# Altium schematic sheet PDC.SchDoc
size C
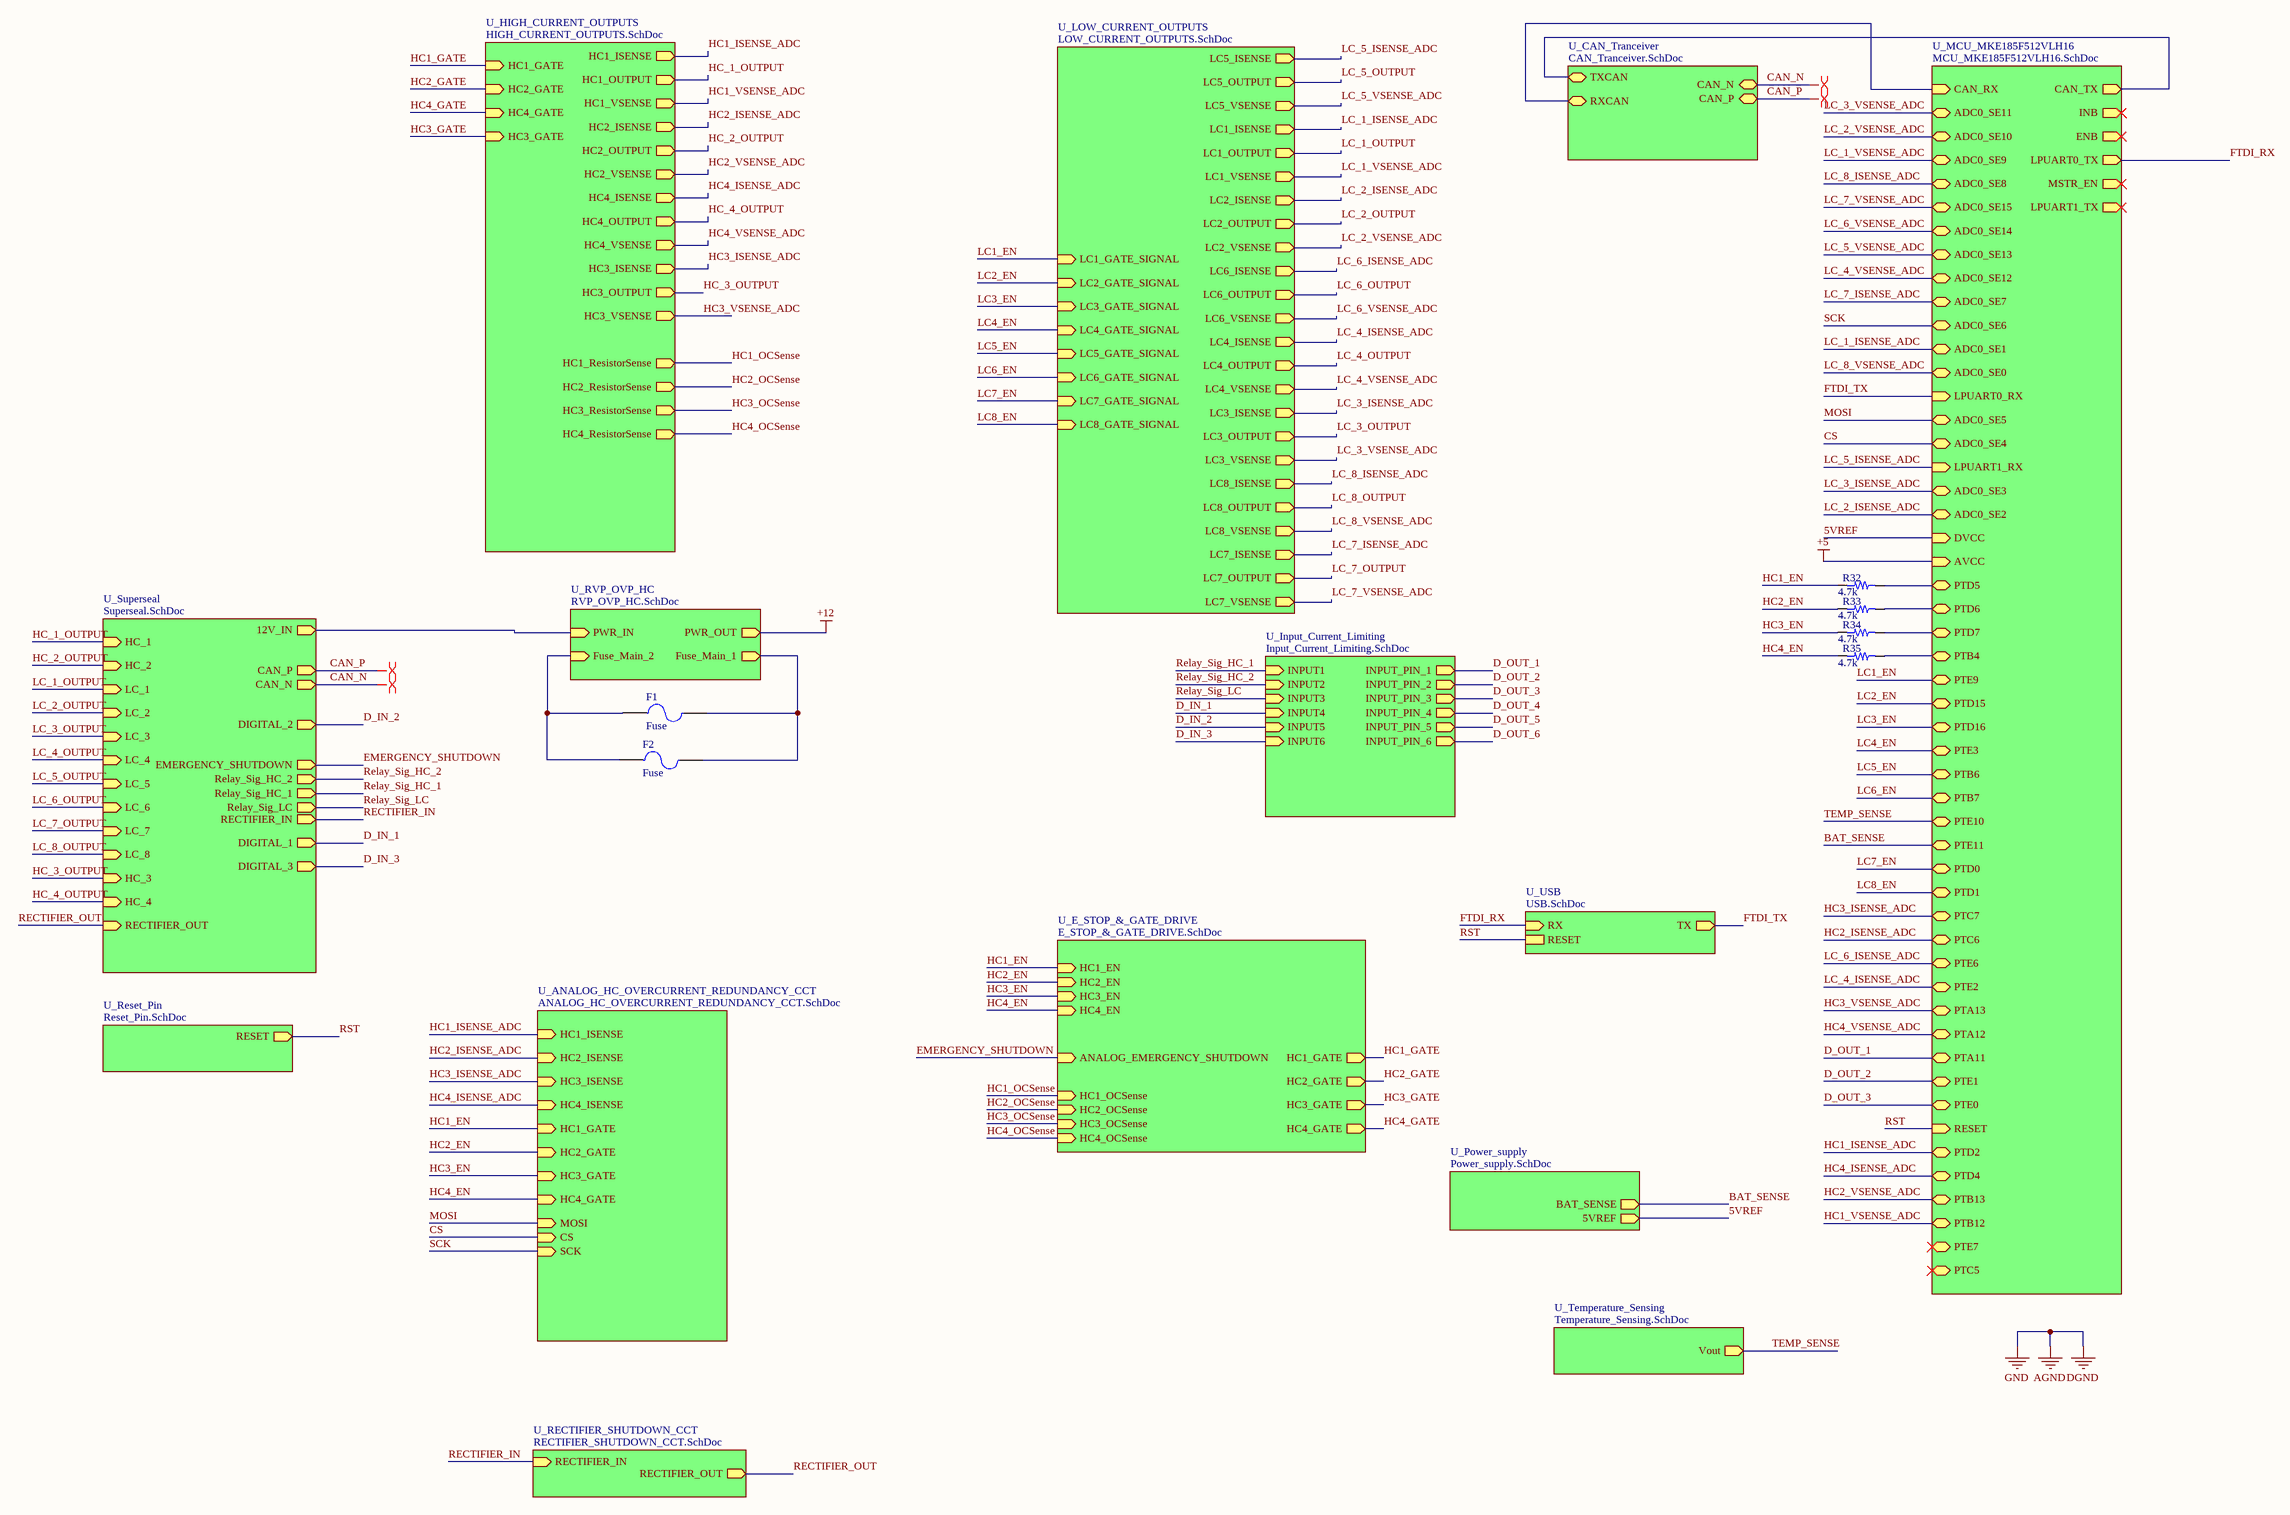
[diagram p0: PDC.SchDoc]

## Parts
F1  Fuse  [3568-MiniFuseHolder]
F2  Fuse  [3568-MiniFuseHolder]
R32  4.7k  [RES 0603/1608]
R33  4.7k  [RES 0603/1608]
R34  4.7k  [RES 0603/1608]
R35  4.7k  [RES 0603/1608]

## Sub-sheets
U_ANALOG_HC_OVERCURRENT_REDUNDANCY_CCT = ANALOG_HC_OVERCURRENT_REDUNDANCY_CCT.SchDoc: HC1_ISENSE (in), HC2_ISENSE (in), HC3_ISENSE (in), HC4_ISENSE (in), HC1_GATE (in), HC2_GATE (in), HC3_GATE (in), HC4_GATE (in), MOSI (in), CS (in), SCK (in)
U_CAN_Tranceiver = CAN_Tranceiver.SchDoc: TXCAN (bidir), RXCAN (bidir), CAN_N (bidir), CAN_P (bidir)
U_E_STOP_&_GATE_DRIVE = E_STOP_&_GATE_DRIVE.SchDoc: HC1_GATE (out), HC2_GATE (out), HC3_GATE (out), HC4_GATE (out), HC1_EN (in), HC4_EN (in), HC3_EN (in), HC2_EN (in), ANALOG_EMERGENCY_SHUTDOWN (in), HC1_OCSense (in), HC2_OCSense (in), HC4_OCSense (in), HC3_OCSense (in)
U_HIGH_CURRENT_OUTPUTS = HIGH_CURRENT_OUTPUTS.SchDoc: HC1_GATE (in), HC1_ISENSE (out), HC1_OUTPUT (out), HC1_VSENSE (out), HC2_GATE (in), HC2_ISENSE (out), HC2_OUTPUT (out), HC2_VSENSE (out), HC4_GATE (in), HC4_ISENSE (out), HC4_OUTPUT (out), HC4_VSENSE (out), HC3_GATE (in), HC3_ISENSE (out), HC3_OUTPUT (out), HC3_VSENSE (out), HC3_ResistorSense (out), HC4_ResistorSense (out), HC2_ResistorSense (out), HC1_ResistorSense (out)
U_Input_Current_Limiting = Input_Current_Limiting.SchDoc: INPUT_PIN_1 (out), INPUT_PIN_2 (out), INPUT1 (in), INPUT2 (in), INPUT_PIN_3 (out), INPUT3 (in), INPUT4 (in), INPUT_PIN_4 (out), INPUT_PIN_5 (out), INPUT5 (in), INPUT6 (in), INPUT_PIN_6 (out)
U_LOW_CURRENT_OUTPUTS = LOW_CURRENT_OUTPUTS.SchDoc: LC5_ISENSE (out), LC5_OUTPUT (out), LC5_VSENSE (out), LC1_ISENSE (out), LC1_OUTPUT (out), LC1_VSENSE (out), LC2_ISENSE (out), LC2_OUTPUT (out), LC2_VSENSE (out), LC6_ISENSE (out), LC6_OUTPUT (out), LC6_VSENSE (out), LC4_ISENSE (out), LC4_OUTPUT (out), LC4_VSENSE (out), LC3_ISENSE (out), LC3_OUTPUT (out), LC3_VSENSE (out), LC8_ISENSE (out), LC8_OUTPUT (out), LC8_VSENSE (out), LC7_ISENSE (out), LC7_OUTPUT (out), LC7_VSENSE (out), LC1_GATE_SIGNAL (in), LC2_GATE_SIGNAL (in), LC3_GATE_SIGNAL (in), LC4_GATE_SIGNAL (in), LC5_GATE_SIGNAL (in), LC6_GATE_SIGNAL (in), LC7_GATE_SIGNAL (in), LC8_GATE_SIGNAL (in)
U_MCU_MKE185F512VLH16 = MCU_MKE185F512VLH16.SchDoc: CAN_TX (out), CAN_RX (in), INB (out), ENB (out), ADC0_SE11 (bidir), ADC0_SE10 (bidir), ADC0_SE9 (bidir), ADC0_SE8 (bidir), ADC0_SE15 (bidir), ADC0_SE14 (bidir), ADC0_SE13 (bidir), ADC0_SE12 (bidir), ADC0_SE7 (bidir), ADC0_SE6 (bidir), ADC0_SE1 (bidir), ADC0_SE0 (bidir), LPUART0_TX (out), LPUART0_RX (in), MSTR_EN (out), ADC0_SE5 (bidir), ADC0_SE4 (bidir), LPUART1_TX (out), LPUART1_RX (in), ADC0_SE3 (bidir), ADC0_SE2 (bidir), DVCC (in), AVCC (in), PTD5 (bidir), PTD6 (bidir), PTD7 (bidir), PTB4 (bidir), PTE9 (bidir), PTD15 (bidir), PTD16 (bidir), PTE3 (bidir), PTB6 (bidir), PTB7 (bidir), PTE10 (bidir), PTE11 (bidir), PTD0 (bidir), PTD1 (bidir), PTC7 (bidir), PTC6 (bidir), PTE6 (bidir), PTE2 (bidir), PTA13 (bidir), PTA12 (bidir), PTA11 (bidir), PTE1 (bidir), PTE0 (bidir), RESET (in), PTD2 (bidir), PTD4 (bidir), PTB13 (bidir), PTB12 (bidir), PTE7 (bidir), PTC5 (bidir)
U_Power_supply = Power_supply.SchDoc: BAT_SENSE (out), 5VREF (out)
U_RECTIFIER_SHUTDOWN_CCT = RECTIFIER_SHUTDOWN_CCT.SchDoc: RECTIFIER_IN (in), RECTIFIER_OUT (out)
U_Reset_Pin = Reset_Pin.SchDoc: RESET (out)
U_RVP_OVP_HC = RVP_OVP_HC.SchDoc: PWR_IN (in), PWR_OUT (out), Fuse_Main_1 (out), Fuse_Main_2 (in)
U_Superseal = Superseal.SchDoc: 12V_IN (out), HC_1 (in), HC_2 (in), LC_1 (in), LC_2 (in), LC_3 (in), LC_4 (in), LC_5 (in), LC_6 (in), LC_7 (in), LC_8 (in), HC_3 (in), HC_4 (in), DIGITAL_2 (out), RECTIFIER_OUT (in), RECTIFIER_IN (out), DIGITAL_1 (out), DIGITAL_3 (out), EMERGENCY_SHUTDOWN (out), Relay_Sig_HC_2 (out), Relay_Sig_HC_1 (out), Relay_Sig_LC (out), CAN_P (out), CAN_N (out)
U_Temperature_Sensing = Temperature_Sensing.SchDoc: Vout (out)
U_USB = USB.SchDoc: TX (out), RX (in), RESET

## Nets
+5: sheet U_MCU_MKE185F512VLH16/AVCC
+12: sheet U_RVP_OVP_HC/PWR_OUT
5VREF: sheet U_MCU_MKE185F512VLH16/DVCC, sheet U_Power_supply/5VREF
BAT_SENSE: sheet U_MCU_MKE185F512VLH16/PTE11, sheet U_Power_supply/BAT_SENSE
CAN_N: sheet U_Superseal/CAN_N, sheet U_CAN_Tranceiver/CAN_N
CAN_P: sheet U_Superseal/CAN_P, sheet U_CAN_Tranceiver/CAN_P
CS: sheet U_MCU_MKE185F512VLH16/ADC0_SE4, sheet U_ANALOG_HC_OVERCURRENT_REDUNDANCY_CCT/CS
D_IN_1: sheet U_Superseal/DIGITAL_1, sheet U_Input_Current_Limiting/INPUT4
D_IN_2: sheet U_Superseal/DIGITAL_2, sheet U_Input_Current_Limiting/INPUT5
D_IN_3: sheet U_Superseal/DIGITAL_3, sheet U_Input_Current_Limiting/INPUT6
D_OUT_1: sheet U_MCU_MKE185F512VLH16/PTA11, sheet U_Input_Current_Limiting/INPUT_PIN_1
D_OUT_2: sheet U_MCU_MKE185F512VLH16/PTE1, sheet U_Input_Current_Limiting/INPUT_PIN_2
D_OUT_3: sheet U_MCU_MKE185F512VLH16/PTE0, sheet U_Input_Current_Limiting/INPUT_PIN_3
D_OUT_4: sheet U_Input_Current_Limiting/INPUT_PIN_4
D_OUT_5: sheet U_Input_Current_Limiting/INPUT_PIN_5
D_OUT_6: sheet U_Input_Current_Limiting/INPUT_PIN_6
EMERGENCY_SHUTDOWN: sheet U_Superseal/EMERGENCY_SHUTDOWN, sheet U_E_STOP_&_GATE_DRIVE/ANALOG_EMERGENCY_SHUTDOWN
FTDI_RX: sheet U_MCU_MKE185F512VLH16/LPUART0_TX, sheet U_USB/RX
FTDI_TX: sheet U_MCU_MKE185F512VLH16/LPUART0_RX, sheet U_USB/TX
HC1_EN: R32.1 ; sheet U_E_STOP_&_GATE_DRIVE/HC1_EN, sheet U_ANALOG_HC_OVERCURRENT_REDUNDANCY_CCT/HC1_GATE
HC1_GATE: sheet U_E_STOP_&_GATE_DRIVE/HC1_GATE, sheet U_HIGH_CURRENT_OUTPUTS/HC1_GATE
HC1_ISENSE_ADC: sheet U_MCU_MKE185F512VLH16/PTD2, sheet U_HIGH_CURRENT_OUTPUTS/HC1_ISENSE, sheet U_ANALOG_HC_OVERCURRENT_REDUNDANCY_CCT/HC1_ISENSE
HC1_OCSense: sheet U_E_STOP_&_GATE_DRIVE/HC1_OCSense, sheet U_HIGH_CURRENT_OUTPUTS/HC1_ResistorSense
HC1_VSENSE_ADC: sheet U_MCU_MKE185F512VLH16/PTB12, sheet U_HIGH_CURRENT_OUTPUTS/HC1_VSENSE
HC2_EN: R33.1 ; sheet U_E_STOP_&_GATE_DRIVE/HC2_EN, sheet U_ANALOG_HC_OVERCURRENT_REDUNDANCY_CCT/HC2_GATE
HC2_GATE: sheet U_E_STOP_&_GATE_DRIVE/HC2_GATE, sheet U_HIGH_CURRENT_OUTPUTS/HC2_GATE
HC2_ISENSE_ADC: sheet U_MCU_MKE185F512VLH16/PTC6, sheet U_HIGH_CURRENT_OUTPUTS/HC2_ISENSE, sheet U_ANALOG_HC_OVERCURRENT_REDUNDANCY_CCT/HC2_ISENSE
HC2_OCSense: sheet U_E_STOP_&_GATE_DRIVE/HC2_OCSense, sheet U_HIGH_CURRENT_OUTPUTS/HC2_ResistorSense
HC2_VSENSE_ADC: sheet U_MCU_MKE185F512VLH16/PTB13, sheet U_HIGH_CURRENT_OUTPUTS/HC2_VSENSE
HC3_EN: R34.1 ; sheet U_E_STOP_&_GATE_DRIVE/HC3_EN, sheet U_ANALOG_HC_OVERCURRENT_REDUNDANCY_CCT/HC3_GATE
HC3_GATE: sheet U_E_STOP_&_GATE_DRIVE/HC3_GATE, sheet U_HIGH_CURRENT_OUTPUTS/HC3_GATE
HC3_ISENSE_ADC: sheet U_MCU_MKE185F512VLH16/PTC7, sheet U_HIGH_CURRENT_OUTPUTS/HC3_ISENSE, sheet U_ANALOG_HC_OVERCURRENT_REDUNDANCY_CCT/HC3_ISENSE
HC3_OCSense: sheet U_E_STOP_&_GATE_DRIVE/HC3_OCSense, sheet U_HIGH_CURRENT_OUTPUTS/HC3_ResistorSense
HC3_VSENSE_ADC: sheet U_MCU_MKE185F512VLH16/PTA13, sheet U_HIGH_CURRENT_OUTPUTS/HC3_VSENSE
HC4_EN: R35.1 ; sheet U_E_STOP_&_GATE_DRIVE/HC4_EN, sheet U_ANALOG_HC_OVERCURRENT_REDUNDANCY_CCT/HC4_GATE
HC4_GATE: sheet U_E_STOP_&_GATE_DRIVE/HC4_GATE, sheet U_HIGH_CURRENT_OUTPUTS/HC4_GATE
HC4_ISENSE_ADC: sheet U_MCU_MKE185F512VLH16/PTD4, sheet U_HIGH_CURRENT_OUTPUTS/HC4_ISENSE, sheet U_ANALOG_HC_OVERCURRENT_REDUNDANCY_CCT/HC4_ISENSE
HC4_OCSense: sheet U_E_STOP_&_GATE_DRIVE/HC4_OCSense, sheet U_HIGH_CURRENT_OUTPUTS/HC4_ResistorSense
HC4_VSENSE_ADC: sheet U_MCU_MKE185F512VLH16/PTA12, sheet U_HIGH_CURRENT_OUTPUTS/HC4_VSENSE
HC_1_OUTPUT: sheet U_Superseal/HC_1, sheet U_HIGH_CURRENT_OUTPUTS/HC1_OUTPUT
HC_2_OUTPUT: sheet U_Superseal/HC_2, sheet U_HIGH_CURRENT_OUTPUTS/HC2_OUTPUT
HC_3_OUTPUT: sheet U_Superseal/HC_3, sheet U_HIGH_CURRENT_OUTPUTS/HC3_OUTPUT
HC_4_OUTPUT: sheet U_Superseal/HC_4, sheet U_HIGH_CURRENT_OUTPUTS/HC4_OUTPUT
LC1_EN: sheet U_LOW_CURRENT_OUTPUTS/LC1_GATE_SIGNAL, sheet U_MCU_MKE185F512VLH16/PTE9
LC2_EN: sheet U_LOW_CURRENT_OUTPUTS/LC2_GATE_SIGNAL, sheet U_MCU_MKE185F512VLH16/PTD15
LC3_EN: sheet U_LOW_CURRENT_OUTPUTS/LC3_GATE_SIGNAL, sheet U_MCU_MKE185F512VLH16/PTD16
LC4_EN: sheet U_LOW_CURRENT_OUTPUTS/LC4_GATE_SIGNAL, sheet U_MCU_MKE185F512VLH16/PTE3
LC5_EN: sheet U_LOW_CURRENT_OUTPUTS/LC5_GATE_SIGNAL, sheet U_MCU_MKE185F512VLH16/PTB6
LC6_EN: sheet U_LOW_CURRENT_OUTPUTS/LC6_GATE_SIGNAL, sheet U_MCU_MKE185F512VLH16/PTB7
LC7_EN: sheet U_LOW_CURRENT_OUTPUTS/LC7_GATE_SIGNAL, sheet U_MCU_MKE185F512VLH16/PTD0
LC8_EN: sheet U_LOW_CURRENT_OUTPUTS/LC8_GATE_SIGNAL, sheet U_MCU_MKE185F512VLH16/PTD1
LC_1_ISENSE_ADC: sheet U_LOW_CURRENT_OUTPUTS/LC1_ISENSE, sheet U_MCU_MKE185F512VLH16/ADC0_SE1
LC_1_OUTPUT: sheet U_Superseal/LC_1, sheet U_LOW_CURRENT_OUTPUTS/LC1_OUTPUT
LC_1_VSENSE_ADC: sheet U_LOW_CURRENT_OUTPUTS/LC1_VSENSE, sheet U_MCU_MKE185F512VLH16/ADC0_SE9
LC_2_ISENSE_ADC: sheet U_LOW_CURRENT_OUTPUTS/LC2_ISENSE, sheet U_MCU_MKE185F512VLH16/ADC0_SE2
LC_2_OUTPUT: sheet U_Superseal/LC_2, sheet U_LOW_CURRENT_OUTPUTS/LC2_OUTPUT
LC_2_VSENSE_ADC: sheet U_LOW_CURRENT_OUTPUTS/LC2_VSENSE, sheet U_MCU_MKE185F512VLH16/ADC0_SE10
LC_3_ISENSE_ADC: sheet U_LOW_CURRENT_OUTPUTS/LC3_ISENSE, sheet U_MCU_MKE185F512VLH16/ADC0_SE3
LC_3_OUTPUT: sheet U_Superseal/LC_3, sheet U_LOW_CURRENT_OUTPUTS/LC3_OUTPUT
LC_3_VSENSE_ADC: sheet U_LOW_CURRENT_OUTPUTS/LC3_VSENSE, sheet U_MCU_MKE185F512VLH16/ADC0_SE11
LC_4_ISENSE_ADC: sheet U_LOW_CURRENT_OUTPUTS/LC4_ISENSE, sheet U_MCU_MKE185F512VLH16/PTE2
LC_4_OUTPUT: sheet U_Superseal/LC_4, sheet U_LOW_CURRENT_OUTPUTS/LC4_OUTPUT
LC_4_VSENSE_ADC: sheet U_LOW_CURRENT_OUTPUTS/LC4_VSENSE, sheet U_MCU_MKE185F512VLH16/ADC0_SE12
LC_5_ISENSE_ADC: sheet U_LOW_CURRENT_OUTPUTS/LC5_ISENSE, sheet U_MCU_MKE185F512VLH16/LPUART1_RX
LC_5_OUTPUT: sheet U_Superseal/LC_5, sheet U_LOW_CURRENT_OUTPUTS/LC5_OUTPUT
LC_5_VSENSE_ADC: sheet U_LOW_CURRENT_OUTPUTS/LC5_VSENSE, sheet U_MCU_MKE185F512VLH16/ADC0_SE13
LC_6_ISENSE_ADC: sheet U_LOW_CURRENT_OUTPUTS/LC6_ISENSE, sheet U_MCU_MKE185F512VLH16/PTE6
LC_6_OUTPUT: sheet U_Superseal/LC_6, sheet U_LOW_CURRENT_OUTPUTS/LC6_OUTPUT
LC_6_VSENSE_ADC: sheet U_LOW_CURRENT_OUTPUTS/LC6_VSENSE, sheet U_MCU_MKE185F512VLH16/ADC0_SE14
LC_7_ISENSE_ADC: sheet U_LOW_CURRENT_OUTPUTS/LC7_ISENSE, sheet U_MCU_MKE185F512VLH16/ADC0_SE7
LC_7_OUTPUT: sheet U_Superseal/LC_7, sheet U_LOW_CURRENT_OUTPUTS/LC7_OUTPUT
LC_7_VSENSE_ADC: sheet U_LOW_CURRENT_OUTPUTS/LC7_VSENSE, sheet U_MCU_MKE185F512VLH16/ADC0_SE15
LC_8_ISENSE_ADC: sheet U_LOW_CURRENT_OUTPUTS/LC8_ISENSE, sheet U_MCU_MKE185F512VLH16/ADC0_SE8
LC_8_OUTPUT: sheet U_Superseal/LC_8, sheet U_LOW_CURRENT_OUTPUTS/LC8_OUTPUT
LC_8_VSENSE_ADC: sheet U_LOW_CURRENT_OUTPUTS/LC8_VSENSE, sheet U_MCU_MKE185F512VLH16/ADC0_SE0
MOSI: sheet U_MCU_MKE185F512VLH16/ADC0_SE5, sheet U_ANALOG_HC_OVERCURRENT_REDUNDANCY_CCT/MOSI
RECTIFIER_IN: sheet U_Superseal/RECTIFIER_IN, sheet U_RECTIFIER_SHUTDOWN_CCT/RECTIFIER_IN
RECTIFIER_OUT: sheet U_Superseal/RECTIFIER_OUT, sheet U_RECTIFIER_SHUTDOWN_CCT/RECTIFIER_OUT
Relay_Sig_HC_1: sheet U_Superseal/Relay_Sig_HC_1, sheet U_Input_Current_Limiting/INPUT1
Relay_Sig_HC_2: sheet U_Superseal/Relay_Sig_HC_2, sheet U_Input_Current_Limiting/INPUT2
Relay_Sig_LC: sheet U_Superseal/Relay_Sig_LC, sheet U_Input_Current_Limiting/INPUT3
RST: sheet U_Reset_Pin/RESET, sheet U_MCU_MKE185F512VLH16/RESET, sheet U_USB/RESET
SCK: sheet U_MCU_MKE185F512VLH16/ADC0_SE6, sheet U_ANALOG_HC_OVERCURRENT_REDUNDANCY_CCT/SCK
TEMP_SENSE: sheet U_Temperature_Sensing/Vout, sheet U_MCU_MKE185F512VLH16/PTE10
NetF1_1: F1.1 F2.1 ; sheet U_RVP_OVP_HC/Fuse_Main_2
NetF1_2: F1.2 F2.2 ; sheet U_RVP_OVP_HC/Fuse_Main_1
NetR32_2: R32.2 ; sheet U_MCU_MKE185F512VLH16/PTD5
NetR33_2: R33.2 ; sheet U_MCU_MKE185F512VLH16/PTD6
NetR34_2: R34.2 ; sheet U_MCU_MKE185F512VLH16/PTD7
NetR35_2: R35.2 ; sheet U_MCU_MKE185F512VLH16/PTB4
(unnamed): sheet U_Superseal/12V_IN, sheet U_RVP_OVP_HC/PWR_IN
(unnamed): sheet U_CAN_Tranceiver/TXCAN, sheet U_MCU_MKE185F512VLH16/CAN_TX
(unnamed): sheet U_CAN_Tranceiver/RXCAN, sheet U_MCU_MKE185F512VLH16/CAN_RX

## Layout directives
differential pair: CAN_N, CAN_P

## Library data of the parts
F1 F2 = 3: Manufacturer_id: 1; idFuse: 3; Name: 3568 Mini Fuse Holder; Drawer_id: 1
R32-R35 = 1: id: 1; name: 0603 Resistor; percent tolerance: 5; resistance: 4.7k; package: 0603; quantity: 0